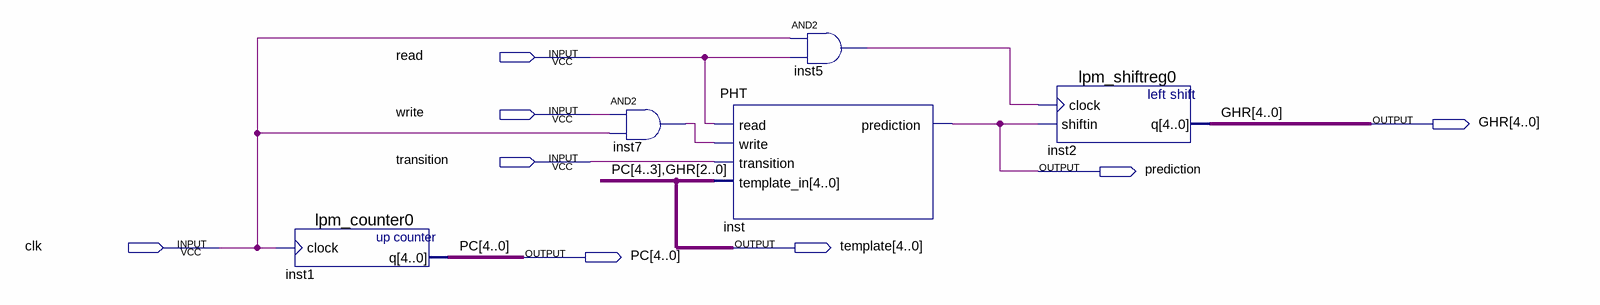
[diagram p0: schematic sheet]
// Quartus schematic Lab7.bdf as structural Verilog: 5 symbols, 8 pins
module Lab7 (
  input  read,
  input  write,
  input  transition,
  input  clk,
  output [4:0] GHR,
  output prediction,
  output [4:0] template,
  output [4:0] PC
);

  wire inst5_out, inst7_out;

  lpm_counter0 inst1 (.clock(clk), .q(PC));
  and inst7 (inst7_out, write, clk);
  PHT inst (
    .read(read), .write(inst7_out), .transition(transition), .template_in({PC[4:3], GHR[2:0]}),
    .prediction(prediction));
  and inst5 (inst5_out, clk, read);
  lpm_shiftreg0 inst2 (.clock(inst5_out), .shiftin(prediction), .q(GHR));

  assign template = {PC[4:3], GHR[2:0]};
endmodule
